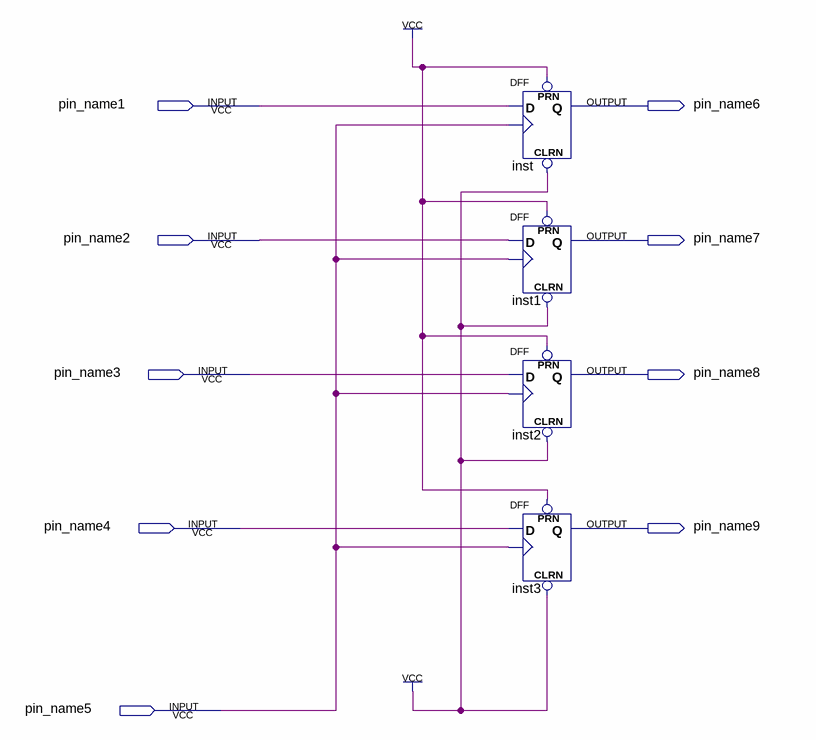
[diagram p0: schematic sheet]
// Quartus schematic Logic Diagram of a 4 bit register.bdf as structural Verilog: 4 symbols, 9 pins
module \Logic_Diagram_of_a_4_bit_register  (
  input  pin_name1,
  input  pin_name2,
  input  pin_name3,
  input  pin_name4,
  input  pin_name5,
  output pin_name6,
  output pin_name7,
  output pin_name8,
  output pin_name9
);

  DFF inst (.CLRN(1'b1), .CLK(pin_name5), .D(pin_name1), .PRN(1'b1), .Q(pin_name6));
  DFF inst1 (.CLRN(1'b1), .CLK(pin_name5), .D(pin_name2), .PRN(1'b1), .Q(pin_name7));
  DFF inst2 (.CLRN(1'b1), .CLK(pin_name5), .D(pin_name3), .PRN(1'b1), .Q(pin_name8));
  DFF inst3 (.CLRN(1'b1), .CLK(pin_name5), .D(pin_name4), .PRN(1'b1), .Q(pin_name9));
endmodule
